# Altium project DIOT_temperature_logger.PrjPCB (part 6 of 6)
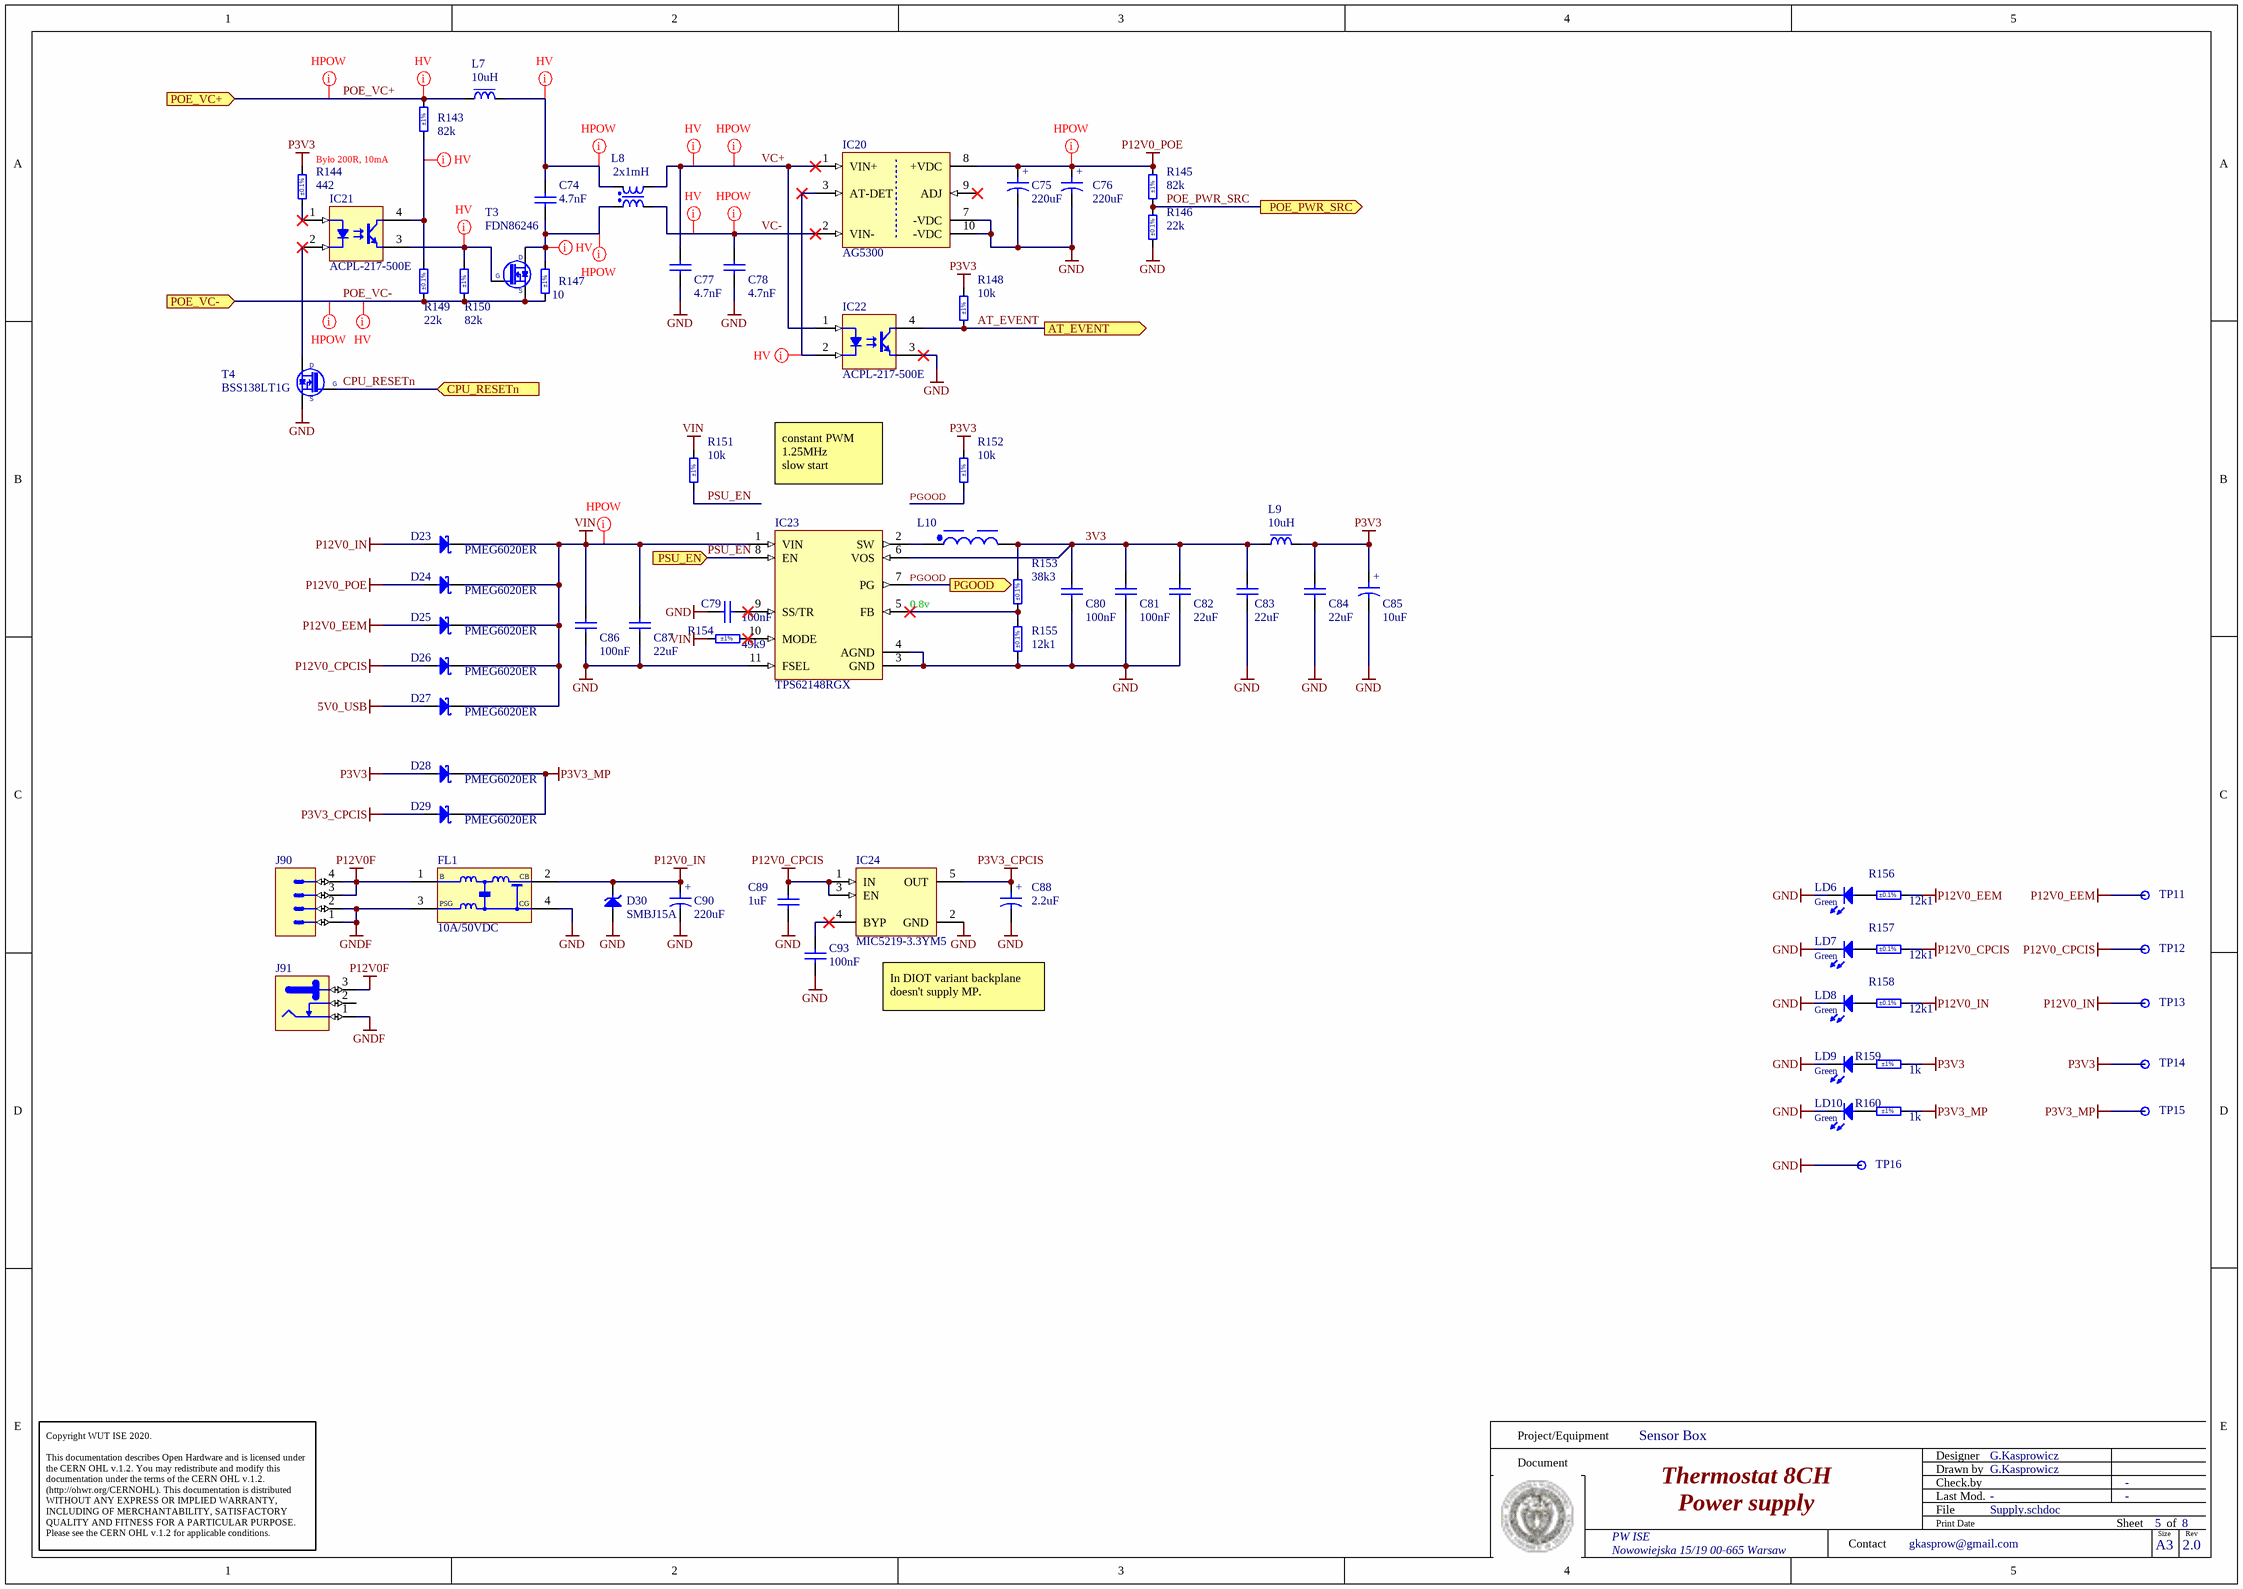
[diagram p107: Supply.schdoc]

## Nets that join several sheets
5V0_USB: USB (F1.1 R139.2), Supply (D27.2)
GND: Thermostat_16CH (13 pins), MCU_STM32F4 (75 pins), USB (11 pins), EEM_DIOT_connector (66 pins), RTD_00 (9 pins), RTD_01 (9 pins), RTD_02 (9 pins), RTD_03 (9 pins), RTD_04 (9 pins), RTD_05 (9 pins), RTD_06 (9 pins), RTD_07 (9 pins), RTD_08 (9 pins), RTD_09 (9 pins), RTD_10 (9 pins), RTD_11 (9 pins), RTD_12 (9 pins), RTD_13 (9 pins), RTD_14 (9 pins), RTD_15 (9 pins), RMII_Ethernet (24 pins), Supply (35 pins)
P3V3: Thermostat_16CH (7 pins), MCU_STM32F4 (54 pins), EEM_DIOT_connector (10 pins), RTD_00 (C65A.2 C66A.1 IC17A.19 L4A.2), RTD_01 (C65B.2 C66B.1 IC17B.19 L4B.2), RTD_02 (C65C.2 C66C.1 IC17C.19 L4C.2), RTD_03 (C65D.2 C66D.1 IC17D.19 L4D.2), RTD_04 (C65E.2 C66E.1 IC17E.19 L4E.2), RTD_05 (C65F.2 C66F.1 IC17F.19 L4F.2), RTD_06 (C65G.2 C66G.1 IC17G.19 L4G.2), RTD_07 (C65H.2 C66H.1 IC17H.19 L4H.2), RTD_08 (C65I.2 C66I.1 IC17I.19 L4I.2), RTD_09 (C65J.2 C66J.1 IC17J.19 L4J.2), RTD_10 (C65K.2 C66K.1 IC17K.19 L4K.2), RTD_11 (C65L.2 C66L.1 IC17L.19 L4L.2), RTD_12 (C65M.2 C66M.1 IC17M.19 L4M.2), RTD_13 (C65N.2 C66N.1 IC17N.19 L4N.2), RTD_14 (C65O.2 C66O.1 IC17O.19 L4O.2), RTD_15 (C65P.2 C66P.1 IC17P.19 L4P.2), RMII_Ethernet (9 pins), Supply (9 pins)
P3V3_CPCIS: EEM_DIOT_connector (15 pins), Supply (C88.1 D29.2 IC24.5)
P3V3_MP: EEM_DIOT_connector (10 pins), Supply (D28.1 D29.1 R160.2 TP15.1)
P12V0_CPCIS: EEM_DIOT_connector (7 pins), Supply (6 pins)
P12V0_EEM: EEM_DIOT_connector (J83.28 J83.29), Supply (D25.2 R156.1 TP11.1)
VIN: MCU_STM32F4 (R57.2), Supply (10 pins)
AFE_SCL: Thermostat_16CH (D21.1 J88.68), MCU_STM32F4 (B2.1 IC13.54 R80.2)
AFE_SDA: Thermostat_16CH (D21.6 J88.34), MCU_STM32F4 (B1.1 IC13.55 R79.2)
AT_EVENT: MCU_STM32F4 (IC13.68), Supply (IC22.4 R148.1)
CPU_RESETn: MCU_STM32F4 (D11.1 IC15.2), Supply (T4.1)
CSN: Thermostat_16CH (R131.2), MCU_STM32F4 (IC13.73), EEM_DIOT_connector (R22.1)
EEM_GPIO_0: Thermostat_16CH (R133.2), MCU_STM32F4 (IC13.56), EEM_DIOT_connector (R36.1)
EEM_GPIO_1: Thermostat_16CH (R134.2), MCU_STM32F4 (IC13.57), EEM_DIOT_connector (R31.1)
EEM_GPIO_2: Thermostat_16CH (R135.2), MCU_STM32F4 (IC13.46), EEM_DIOT_connector (R45.1)
EEM_GPIO_3: Thermostat_16CH (R136.2), MCU_STM32F4 (IC13.47), EEM_DIOT_connector (R42.1)
EEM_SCK: Thermostat_16CH (R132.2), MCU_STM32F4 (IC13.69), EEM_DIOT_connector (R13.1)
EEM_SDI: Thermostat_16CH (R129.2), MCU_STM32F4 (IC13.76), EEM_DIOT_connector (R9.1)
EEM_SDO: Thermostat_16CH (R130.2), MCU_STM32F4 (IC13.75), EEM_DIOT_connector (R27.1)
FORCE_N00: Thermostat_16CH (J88.36), RTD_00 (IC17A.9)
FORCE_N01: Thermostat_16CH (J88.38), RTD_01 (IC17B.9)
FORCE_N02: Thermostat_16CH (J88.40), RTD_02 (IC17C.9)
FORCE_N03: Thermostat_16CH (J88.42), RTD_03 (IC17D.9)
FORCE_N04: Thermostat_16CH (J88.44), RTD_04 (IC17E.9)
FORCE_N05: Thermostat_16CH (J88.46), RTD_05 (IC17F.9)
FORCE_N06: Thermostat_16CH (J88.48), RTD_06 (IC17G.9)
FORCE_N07: Thermostat_16CH (J88.50), RTD_07 (IC17H.9)
FORCE_N08: Thermostat_16CH (J88.52), RTD_08 (IC17I.9)
FORCE_N09: Thermostat_16CH (J88.54), RTD_09 (IC17J.9)
FORCE_N10: Thermostat_16CH (J88.56), RTD_10 (IC17K.9)
FORCE_N11: Thermostat_16CH (J88.58), RTD_11 (IC17L.9)
FORCE_N12: Thermostat_16CH (J88.60), RTD_12 (IC17M.9)
FORCE_N13: Thermostat_16CH (J88.62), RTD_13 (IC17N.9)
FORCE_N14: Thermostat_16CH (J88.64), RTD_14 (IC17O.9)
FORCE_N15: Thermostat_16CH (J88.66), RTD_15 (IC17P.9)
FORCE_P00: Thermostat_16CH (J88.37), RTD_00 (IC17A.5)
FORCE_P01: Thermostat_16CH (J88.39), RTD_01 (IC17B.5)
FORCE_P02: Thermostat_16CH (J88.41), RTD_02 (IC17C.5)
FORCE_P03: Thermostat_16CH (J88.43), RTD_03 (IC17D.5)
FORCE_P04: Thermostat_16CH (J88.45), RTD_04 (IC17E.5)
FORCE_P05: Thermostat_16CH (J88.47), RTD_05 (IC17F.5)
FORCE_P06: Thermostat_16CH (J88.49), RTD_06 (IC17G.5)
FORCE_P07: Thermostat_16CH (J88.51), RTD_07 (IC17H.5)
FORCE_P08: Thermostat_16CH (J88.53), RTD_08 (IC17I.5)
FORCE_P09: Thermostat_16CH (J88.55), RTD_09 (IC17J.5)
FORCE_P10: Thermostat_16CH (J88.57), RTD_10 (IC17K.5)
FORCE_P11: Thermostat_16CH (J88.59), RTD_11 (IC17L.5)
FORCE_P12: Thermostat_16CH (J88.61), RTD_12 (IC17M.5)
FORCE_P13: Thermostat_16CH (J88.63), RTD_13 (IC17N.5)
FORCE_P14: Thermostat_16CH (J88.65), RTD_14 (IC17O.5)
FORCE_P15: Thermostat_16CH (J88.67), RTD_15 (IC17P.5)
I2C_SCL: MCU_STM32F4 (IC13.139), EEM_DIOT_connector (7 pins)
I2C_SDA: MCU_STM32F4 (IC13.140), EEM_DIOT_connector (7 pins)
MAX_CH_A0: Thermostat_16CH (IC18.1 IC19.1 R133.1), MCU_STM32F4 (IC13.81)
MAX_CH_A1: Thermostat_16CH (IC18.2 IC19.2 R134.1), MCU_STM32F4 (IC13.82)
MAX_CH_A2: Thermostat_16CH (IC18.3 IC19.3 R135.1), MCU_STM32F4 (IC13.85)
MAX_CH_A3: Thermostat_16CH (R124.1 R125.1 R136.1), MCU_STM32F4 (IC13.86)
MAX_CS00: Thermostat_16CH (IC18.15), RTD_00 (IC17A.13)
MAX_CS01: Thermostat_16CH (IC18.14), RTD_01 (IC17B.13)
MAX_CS02: Thermostat_16CH (IC18.13), RTD_02 (IC17C.13)
MAX_CS03: Thermostat_16CH (IC18.12), RTD_03 (IC17D.13)
MAX_CS04: Thermostat_16CH (IC18.11), RTD_04 (IC17E.13)
MAX_CS05: Thermostat_16CH (IC18.10), RTD_05 (IC17F.13)
MAX_CS06: Thermostat_16CH (IC18.9), RTD_06 (IC17G.13)
MAX_CS07: Thermostat_16CH (IC18.7), RTD_07 (IC17H.13)
MAX_CS08: Thermostat_16CH (IC19.15), RTD_08 (IC17I.13)
MAX_CS09: Thermostat_16CH (IC19.14), RTD_09 (IC17J.13)
MAX_CS10: Thermostat_16CH (IC19.13), RTD_10 (IC17K.13)
MAX_CS11: Thermostat_16CH (IC19.12), RTD_11 (IC17L.13)
MAX_CS12: Thermostat_16CH (IC19.11), RTD_12 (IC17M.13)
MAX_CS13: Thermostat_16CH (IC19.10), RTD_13 (IC17N.13)
MAX_CS14: Thermostat_16CH (IC19.9), RTD_14 (IC17O.13)
MAX_CS15: Thermostat_16CH (IC19.7), RTD_15 (IC17P.13)
PGOOD: EEM_DIOT_connector (T2.1), Supply (IC23.7 R152.1)
PHY_NRST: MCU_STM32F4 (IC13.129), RMII_Ethernet (IC16.15 R110.2)
POE_PWR_SRC: MCU_STM32F4 (IC13.37), Supply (R145.1 R146.2)
POE_VC+: RMII_Ethernet (D12.1 D13.1 D14.1 D15.1), Supply (L7.1 R143.2)
POE_VC-: RMII_Ethernet (D17.2 D18.2 D19.2 D20.2), Supply (R147.1 R149.1 R150.1 T3.2)
PSU_EN: EEM_DIOT_connector (R33.2 R165.2 T7.3), Supply (IC23.8 R151.1)
RMII_CRS_DV: MCU_STM32F4 (IC13.43), RMII_Ethernet (R105.1)
RMII_MDC: MCU_STM32F4 (IC13.27), RMII_Ethernet (B3.1 IC16.13)
RMII_MDIO: MCU_STM32F4 (IC13.36), RMII_Ethernet (B4.1 IC16.12 R107.2)
RMII_REF_CLK: MCU_STM32F4 (IC13.35), RMII_Ethernet (R109.1)
RMII_RXD0: MCU_STM32F4 (IC13.44), RMII_Ethernet (R98.1)
RMII_RXD1: MCU_STM32F4 (IC13.45), RMII_Ethernet (R100.1)
RMII_TX_EN: MCU_STM32F4 (IC13.126), RMII_Ethernet (IC16.16)
RMII_TXD0: MCU_STM32F4 (IC13.128), RMII_Ethernet (IC16.17)
RMII_TXD1: MCU_STM32F4 (IC13.127), RMII_Ethernet (IC16.18)
RSTn: MCU_STM32F4 (D11.2 IC13.25 J86.10 R89.1), EEM_DIOT_connector (D3.1)
RTDIN_N00: Thermostat_16CH (J88.2), RTD_00 (C62A.1 IC17A.8)
RTDIN_N01: Thermostat_16CH (J88.4), RTD_01 (C62B.1 IC17B.8)
RTDIN_N02: Thermostat_16CH (J88.6), RTD_02 (C62C.1 IC17C.8)
RTDIN_N03: Thermostat_16CH (J88.8), RTD_03 (C62D.1 IC17D.8)
RTDIN_N04: Thermostat_16CH (J88.10), RTD_04 (C62E.1 IC17E.8)
RTDIN_N05: Thermostat_16CH (J88.12), RTD_05 (C62F.1 IC17F.8)
RTDIN_N06: Thermostat_16CH (J88.14), RTD_06 (C62G.1 IC17G.8)
RTDIN_N07: Thermostat_16CH (J88.16), RTD_07 (C62H.1 IC17H.8)
RTDIN_N08: Thermostat_16CH (J88.18), RTD_08 (C62I.1 IC17I.8)
RTDIN_N09: Thermostat_16CH (J88.20), RTD_09 (C62J.1 IC17J.8)
RTDIN_N10: Thermostat_16CH (J88.22), RTD_10 (C62K.1 IC17K.8)
RTDIN_N11: Thermostat_16CH (J88.24), RTD_11 (C62L.1 IC17L.8)
RTDIN_N12: Thermostat_16CH (J88.26), RTD_12 (C62M.1 IC17M.8)
RTDIN_N13: Thermostat_16CH (J88.28), RTD_13 (C62N.1 IC17N.8)
RTDIN_N14: Thermostat_16CH (J88.30), RTD_14 (C62O.1 IC17O.8)
RTDIN_N15: Thermostat_16CH (J88.32), RTD_15 (C62P.1 IC17P.8)
RTDIN_P00: Thermostat_16CH (J88.3), RTD_00 (C62A.2 IC17A.7 R119A.2)
RTDIN_P01: Thermostat_16CH (J88.5), RTD_01 (C62B.2 IC17B.7 R119B.2)
RTDIN_P02: Thermostat_16CH (J88.7), RTD_02 (C62C.2 IC17C.7 R119C.2)
RTDIN_P03: Thermostat_16CH (J88.9), RTD_03 (C62D.2 IC17D.7 R119D.2)
RTDIN_P04: Thermostat_16CH (J88.11), RTD_04 (C62E.2 IC17E.7 R119E.2)
RTDIN_P05: Thermostat_16CH (J88.13), RTD_05 (C62F.2 IC17F.7 R119F.2)
RTDIN_P06: Thermostat_16CH (J88.15), RTD_06 (C62G.2 IC17G.7 R119G.2)
RTDIN_P07: Thermostat_16CH (J88.17), RTD_07 (C62H.2 IC17H.7 R119H.2)
RTDIN_P08: Thermostat_16CH (J88.19), RTD_08 (C62I.2 IC17I.7 R119I.2)
RTDIN_P09: Thermostat_16CH (J88.21), RTD_09 (C62J.2 IC17J.7 R119J.2)
RTDIN_P10: Thermostat_16CH (J88.23), RTD_10 (C62K.2 IC17K.7 R119K.2)
RTDIN_P11: Thermostat_16CH (J88.25), RTD_11 (C62L.2 IC17L.7 R119L.2)
RTDIN_P12: Thermostat_16CH (J88.27), RTD_12 (C62M.2 IC17M.7 R119M.2)
RTDIN_P13: Thermostat_16CH (J88.29), RTD_13 (C62N.2 IC17N.7 R119N.2)
RTDIN_P14: Thermostat_16CH (J88.31), RTD_14 (C62O.2 IC17O.7 R119O.2)
RTDIN_P15: Thermostat_16CH (J88.33), RTD_15 (C62P.2 IC17P.7 R119P.2)
SPI4_CLK: Thermostat_16CH (R132.1), MCU_STM32F4 (IC13.65), RTD_00 (IC17A.12), RTD_01 (IC17B.12), RTD_02 (IC17C.12), RTD_03 (IC17D.12), RTD_04 (IC17E.12), RTD_05 (IC17F.12), RTD_06 (IC17G.12), RTD_07 (IC17H.12), RTD_08 (IC17I.12), RTD_09 (IC17J.12), RTD_10 (IC17K.12), RTD_11 (IC17L.12), RTD_12 (IC17M.12), RTD_13 (IC17N.12), RTD_14 (IC17O.12), RTD_15 (IC17P.12)
SPI4_MISO: Thermostat_16CH (R130.1), MCU_STM32F4 (IC13.66), RTD_00 (IC17A.14), RTD_01 (IC17B.14), RTD_02 (IC17C.14), RTD_03 (IC17D.14), RTD_04 (IC17E.14), RTD_05 (IC17F.14), RTD_06 (IC17G.14), RTD_07 (IC17H.14), RTD_08 (IC17I.14), RTD_09 (IC17J.14), RTD_10 (IC17K.14), RTD_11 (IC17L.14), RTD_12 (IC17M.14), RTD_13 (IC17N.14), RTD_14 (IC17O.14), RTD_15 (IC17P.14)
SPI4_MOSI: Thermostat_16CH (R129.1), MCU_STM32F4 (IC13.67), RTD_00 (IC17A.11), RTD_01 (IC17B.11), RTD_02 (IC17C.11), RTD_03 (IC17D.11), RTD_04 (IC17E.11), RTD_05 (IC17F.11), RTD_06 (IC17G.11), RTD_07 (IC17H.11), RTD_08 (IC17I.11), RTD_09 (IC17J.11), RTD_10 (IC17K.11), RTD_11 (IC17L.11), RTD_12 (IC17M.11), RTD_13 (IC17N.11), RTD_14 (IC17O.11), RTD_15 (IC17P.11)
SPI4_NSS: Thermostat_16CH (R126.1 R127.1 R128.1 R131.1), MCU_STM32F4 (IC13.64)
USB_N: MCU_STM32F4 (IC13.103), USB (D22.3 L6.2)
USB_P: MCU_STM32F4 (IC13.104), USB (D22.4 L6.3)
USB_VBUS: MCU_STM32F4 (IC13.101), USB (R141.2)

## Assembly variants
Standard MCU: not fitted J91 R129 R130 R131 R132 R133 R134 R135 R136 W1
No MCU: not fitted BAT1 BATH1 C3 C4 C18 C19 C20 C21 C22 C23 C24 C25 C26 C27 C28 C29 C30 C31 C32 C33 C34 C35 C36 C37 C38 C39 C40 C41 C42 C43 C44 C45 C46 C47 C48 C49 C50 C51 C52 C53 C54 C55 C56 C57 C58 C59 C60 C61 C72 C73 C74 C75 C76 C77 C78 C92 D1 D2 D8 D9 D10 D12 D13 D14 D15 D16 D17 D18 D19 D20 D21 D22 F1 IC1 IC2 IC13 IC14 IC16 IC20 IC21 IC22 J85 J86 J87 J89 J91 JP1 L1 L2 L3 L5 L6 L7 L8 LD4 LD5 Q1 Q2 Q3 R56 R57 R58 R59 R60 R61 R62 R63 R64 R65 R66 R67 R68 R69 R70 R71 R72 R73 R74 R75 R76 R77 R78 R79 R80 R81 R82 R83 R84 R85 R86 R87 R88 R90 R91 R92 R93 R94 R95 R96 R97 R98 R99 R100 R101 R102 R103 R104 R105 R106 R107 R108 R109 R110 R111 R112 R113 R114 R115 R137 R138 R139 R140 R141 R142 R143 R144 R145 R146 R147 R148 R149 R150 T3 T4 U1 W1 W2